# EAGLE design attinier85-motherboard-pth-mk-2.0 (EAGLE 7.5.0)
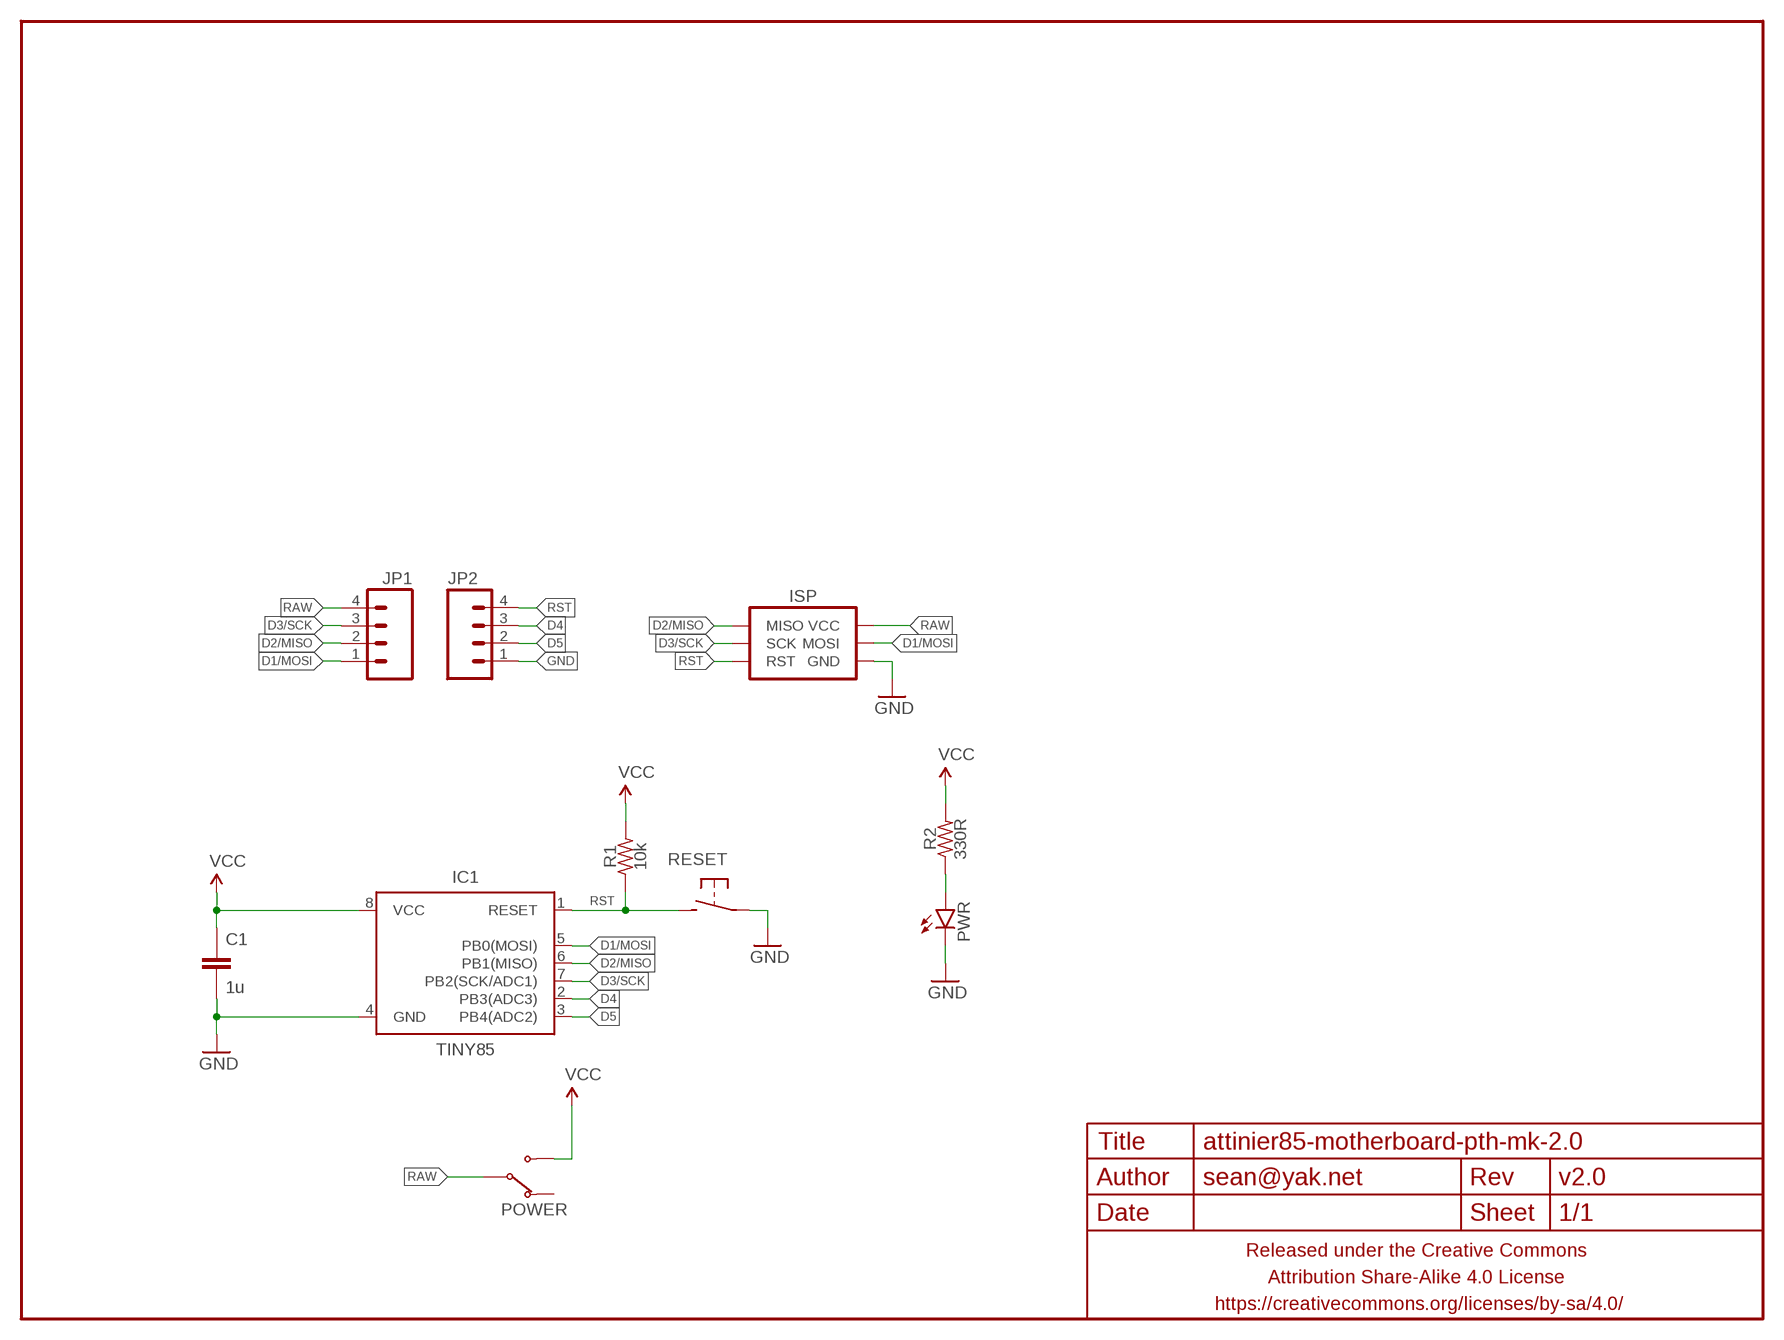
[diagram p0: schematic, sheet 1]

## Parts
C1  1u  CAPACITOR-CERAMIC025-024X044  [C025-024X044]
FRAME1  FRAME-LETTERNO_PACKAGE  [DUMMY]
IC1  TINY85  ATTINY45TINY85-20-DIP  [DIP08]
ISP  AVR_SPI_PRG_6PTH  [2X3]
JP1  M04PTH  [1X04-PTH-VERT]
JP2  M04PTH  [1X04-PTH-VERT]
POWER  SWITCH-SPDTPTH-RA-2.54MM-CENTERED  [SPDT-RA-2.54MM-CENTERED]
PWR  LED3MM-LESS  [LED3MM-LESSSILK]
R1  10k  RESISTORPTH-AXIAL-5.08MM  [RESISTOR-AXIAL-PTH-5.08MM]
R2  330R  RESISTORPTH-AXIAL-5.08MM  [RESISTOR-AXIAL-PTH-5.08MM]
RESET  DTS-6MM  SPST-NO-TACT3MM-PTH-SMALL-PADS  [DTS-3-SMALL-PADS]

## Nets
D1/MOSI: IC1.5(PB0(MOSI)) ISP.4(MOSI) JP1.1
D2/MISO: IC1.6(PB1(MISO)) ISP.1(MISO) JP1.2
D3/SCK: IC1.7(PB2(SCK/ADC1)) ISP.3(SCK) JP1.3
D4: IC1.2(PB3(ADC3)) JP2.3
D5: IC1.3(PB4(ADC2)) JP2.2
GND: C1.2 IC1.4(GND) ISP.6(GND) JP2.1 PWR.K(C) RESET.1
N$1: PWR.A R2.P$1
RAW: ISP.2(VCC) JP1.4 POWER.2(COM)
RST: IC1.1(RESET) ISP.5(RST) JP2.4 R1.P$1 RESET.2
VCC: C1.1 IC1.8(VCC) POWER.3(NO) R1.P$2 R2.P$2
Unconnected: POWER.1(NC)

## Library data of the parts
C1 = a_parts:CAPACITOR-CERAMIC: CAPACITOR, European symbol
FRAME1 = a_parts:FRAME-LETTER: Schematic Frame Standard 8.5x11 US Letter frame; DESIGNER: sean@yak.net; VERSION: v2.0
IC1 = a_parts:ATTINY45: Atmel 8-pin 2/4/8kB flash uC; PROD_ID: IC-09445; VALUE: TINY85-20-DIP
ISP = a_parts:AVR_SPI_PRG_6: AVR ISP 6 Pin This is the reduced ISP connector for AVR programming. Common on Arduino. This footprint will take up less PCB space and can be used with a 10-pin to 6-pin adapter such as SKU: BOB-08508 **Special note about "TEST_POINT" package. The stop mask is on the top side, so if you want your programming test points to be on the bottom of your board, make sure to place this package on the bottom side of the board. This also ensure that the orientation to program from the bottom side will be correct.
JP1 JP2 = a_parts:M04: Header 4 Standard 4-pin 0.1" header. Use with straight break away headers (SKU : PRT-00116), right angle break away headers (PRT-00553), swiss pins (PRT-00743), machine pins (PRT-00117), and female headers (PRT-00115). Molex polarized connector foot print use with SKU : PRT-08231 with associated crimp pins and housings. 1MM SMD Version SKU: PRT-10208
POWER = a_parts:SWITCH-SPDT
PWR = a_parts:LED: LEDs Standard schematic elements and footprints for 5mm, 3mm, 1206, and 0603 sized LEDs. 5mm - Spark Fun Electronics SKU : COM-00529 (and others)
R1 R2 = a_parts:RESISTOR: RESISTOR, American symbol
RESET = a_parts:SPST-NO-TACT

## Board
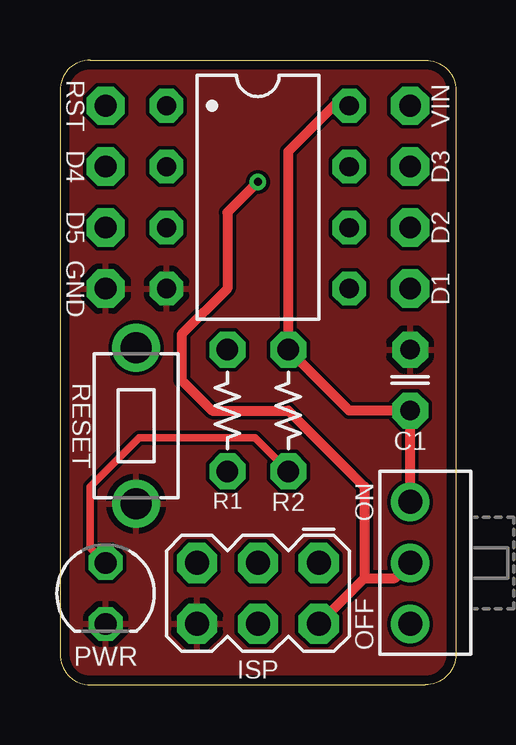
[diagram p1: board, top side]
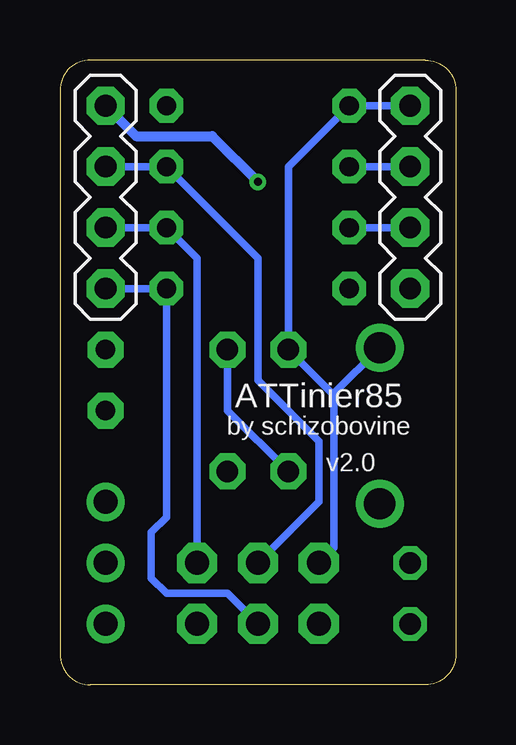
[diagram p2: board, bottom side, seen from below]

Size 16.51 x 26.04 mm. Coordinates in mm from the lower left corner, seen from the top.
Outline: 1.27,26.04 15.24,26.04 arc-90 16.51,24.77 16.51,1.27 arc-90 15.24,0 1.27,0 arc-90 0,1.27 0,24.77 arc-90 1.27,26.04
Copper layers (1*16): Top 0.0356mm / dielectric 1.5011mm / Bottom 0.0356mm
Design rules "LaenPCBOrder2": minimum track width 6mil, minimum drill 13mil, track to track 6mil, track to pad 6mil, pad to pad 6mil, via to via 6mil, smd to smd 6mil, copper to edge 15mil, drill to drill 6mil, minimum pad ring 7mil, minimum via ring 7mil, stop-mask expansion 3mil, vias tented up to drill 20mil, thermal gap 10mil

### Footprints (pad centres in the part's own frame; a part is rotated, then mirrored left to right if it is on the bottom)
C025-024X044 = drill 0.813 pad 1.5 octagon: 1 -1.27,0; 2 1.27,0
DIP08 = drill 0.8 pad 1.4 octagon: 1 -3.81,-3.81; 2 -1.27,-3.81; 3 1.27,-3.81; 4 3.81,-3.81; 5 3.81,3.81; 6 1.27,3.81; 7 -1.27,3.81; 8 -3.81,3.81
2X3 = drill 1 pad 1.676 octagon: 1 -2.54,-1.27; 2 -2.54,1.27; 3 0,-1.27; 4 0,1.27; 5 2.54,-1.27; 6 2.54,1.27
1X04-PTH-VERT = drill 0.9 pad 1.6 octagon: 1 0,0; 2 2.54,0; 3 5.08,0; 4 7.62,0
SPDT-RA-2.54MM-CENTERED = drill 1 pad 1.6: 1 -2.54,0; 2 0,0; 3 2.54,0
LED3MM-LESSSILK = drill 0.9 pad 1.4 octagon: A -1.27,0; K 1.27,0
RESISTOR-AXIAL-PTH-5.08MM = drill 0.9 pad 1.5 octagon: P$1 -2.54,0; P$2 2.54,0
DTS-3-SMALL-PADS = drill 1.3 pad 2: 1 -3.25,0; 2 3.25,0

### Placement (x,y rotation side)
C1  14.61,12.7 90 top
FRAME1  0,0 0 top
IC1  8.26,20.32 270 top
ISP  8.26,3.81 180 top
JP1  14.61,16.51 90 bottom
JP2  1.91,16.51 90 bottom
POWER  14.61,5.08 90 top
PWR  1.91,3.81 270 top
R1  6.99,11.43 270 top
R2  9.53,11.43 90 top
RESET  3.17,10.79 90 top

### Tracks (layer width: path | path; a pad name or v marks a point on that pad's centre or on a via)
D1/MOSI
  Bottom 0.305: JP1.1 IC1.5 12.06,6.99 12.7,6.35 12.7,4.45 12.06,3.81 9.53,3.81 ISP.4
D2/MISO
  Bottom 0.305: JP1.2 IC1.6 10.79,17.78 ISP.1
D3/SCK
  Bottom 0.305: JP1.3 IC1.7 8.32,17.84 8.26,17.78 8.26,12.7 5.71,10.16 5.71,7.62 ISP.3
D4
  Bottom 0.305: JP2.3 IC1.2
D5
  Bottom 0.305: JP2.2 IC1.3
GND
  pour Top: 15.24,0 1.27,0 arc-90 0,1.27 0,24.77 arc-90 1.27,26.04 15.24,26.04 arc-90 16.51,24.77 16.51,1.27 arc-90
N$1
  Top 0.305: R2.P$1 8.13,10.29 3.3,10.29 1.27,8.26 1.27,5.71 PWR.A
RAW  (via drill 0.33)
  Top 0.406: v8.26,20.95 6.99,19.68 6.99,16.51 5.08,14.61 5.08,12.7 6.35,11.43 9.53,11.43 12.7,8.26 12.7,4.45 | 12.7,4.45 13.97,4.45 POWER.2 | ISP.2 12.7,4.45
  Bottom 0.406: JP1.4 13.34,22.86 10.16,22.86 v8.26,20.95
RST
  Bottom 0.305: JP2.4 IC1.1 6.99,21.59 R1.P$1 5.08,12.06 | ISP.5 5.08,5.71 5.08,12.06 | 5.08,12.06 5.08,12.14 RESET.2
VCC
  Top 0.406: POWER.3 C1.1 12.06,11.43 R2.P$2 9.53,22.23 11.43,24.13 IC1.8
  Bottom 0.305: R1.P$2 9.53,11.43 R2.P$2

### Text on the board
tPlace: ON | OFF
bPlace: ATTinier85 | by schizobovine
tNames: RST | VIN | D4 | D3 | D5 | D2 | GND | D1